# EAGLE design Nodemcu_Door_Sensor (EAGLE 7.2.0)
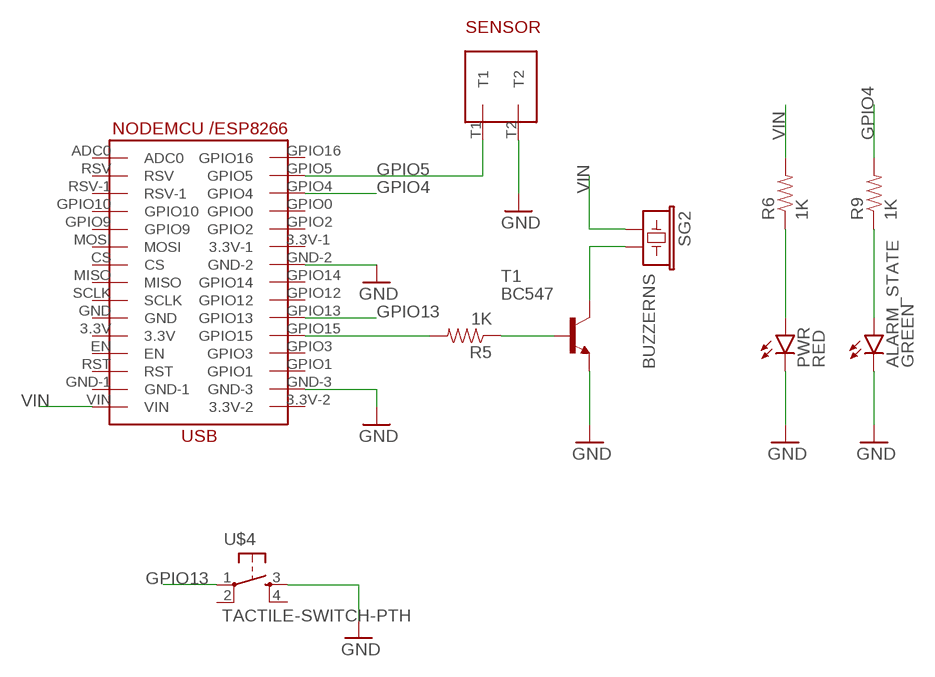
[diagram p0: schematic, sheet 1]

## Parts
ALARM_STATE  GREEN  LED3MM  [LED3MM]
PWR  RED  LED3MM  [LED3MM]
R5  1K  RESISTORPTH-1/4W  [AXIAL-0.4]
R6  1K  RESISTORPTH-1/4W  [AXIAL-0.4]
R9  1K  RESISTORPTH-1/4W  [AXIAL-0.4]
SENSOR  TER_CON_2PIN_ROINCOPTH  [TER_CON_2PIN_ROINCO]
SG2  BUZZERNS  [BUZZER-12MM-NS]
T1  BC547  [TO92]
U$1  ROINCO_NODEMCU_ESP8266  [ROINCO_NODEMCU_ESP8266]
U$4  TACTILE-SWITCH-PTH  [TAC-SWITCH-PTH]

## Nets
GND: ALARM_STATE.K(C) PWR.K(C) SENSOR.T2 T1.1(E) U$1.GND-2 U$1.GND-3 U$4.3
GPIO4: R9.P$2 U$1.GPIO4
GPIO5: SENSOR.T1 U$1.GPIO5
GPIO13: U$1.GPIO13 U$4.1
N$5: R5.P$2 U$1.GPIO15
N$8: R5.P$1 T1.2(B)
N$13: SG2.- T1.3(C)
N$16: PWR.A R6.P$1
N$18: ALARM_STATE.A R9.P$1
VIN: R6.P$2 SG2.+ U$1.VIN
Unconnected: U$1.3.3V U$1.3.3V-1 U$1.3.3V-2 U$1.ADC0 U$1.CS U$1.EN U$1.GND U$1.GND-1 U$1.GPIO0 U$1.GPIO1 U$1.GPIO2 U$1.GPIO3 U$1.GPIO9 U$1.GPIO10 U$1.GPIO12 U$1.GPIO14 U$1.GPIO16 U$1.MISO U$1.MOSI U$1.RST U$1.RSV U$1.RSV-1 U$1.SCLK U$4.2 U$4.4

## Notes on the sheet
- SENSOR

## Library data of the parts
ALARM_STATE PWR = SparkFun-LED:LED: LEDs Standard schematic elements and footprints for 5mm, 3mm, 1206, and 0603 sized LEDs. 5mm - Spark Fun Electronics SKU : COM-00529 (and others)
R5 R6 R9 = SparkFun-Resistors:RESISTOR: Resistor Basic schematic elements and footprints for 0603, 1206, and PTH resistors.
SENSOR = TER CON 2PIN ROINCO:TER_CON_2PIN_ROINCO
SG2 = SparkFun-Electromechanical:BUZZER: Buzzer 12mm Spark Fun Electronics SKU : Comp-Buzzer
T1 = transistor:BC547: NPN TRANSISTOR
U$1 = ESP8266 ESP32 ROINCO:ROINCO_NODEMCU_ESP8266
U$4 = GeekAmmo:TACTILE-SWITCH: Tactile Switch 4 Pins, SPST NO

## Board
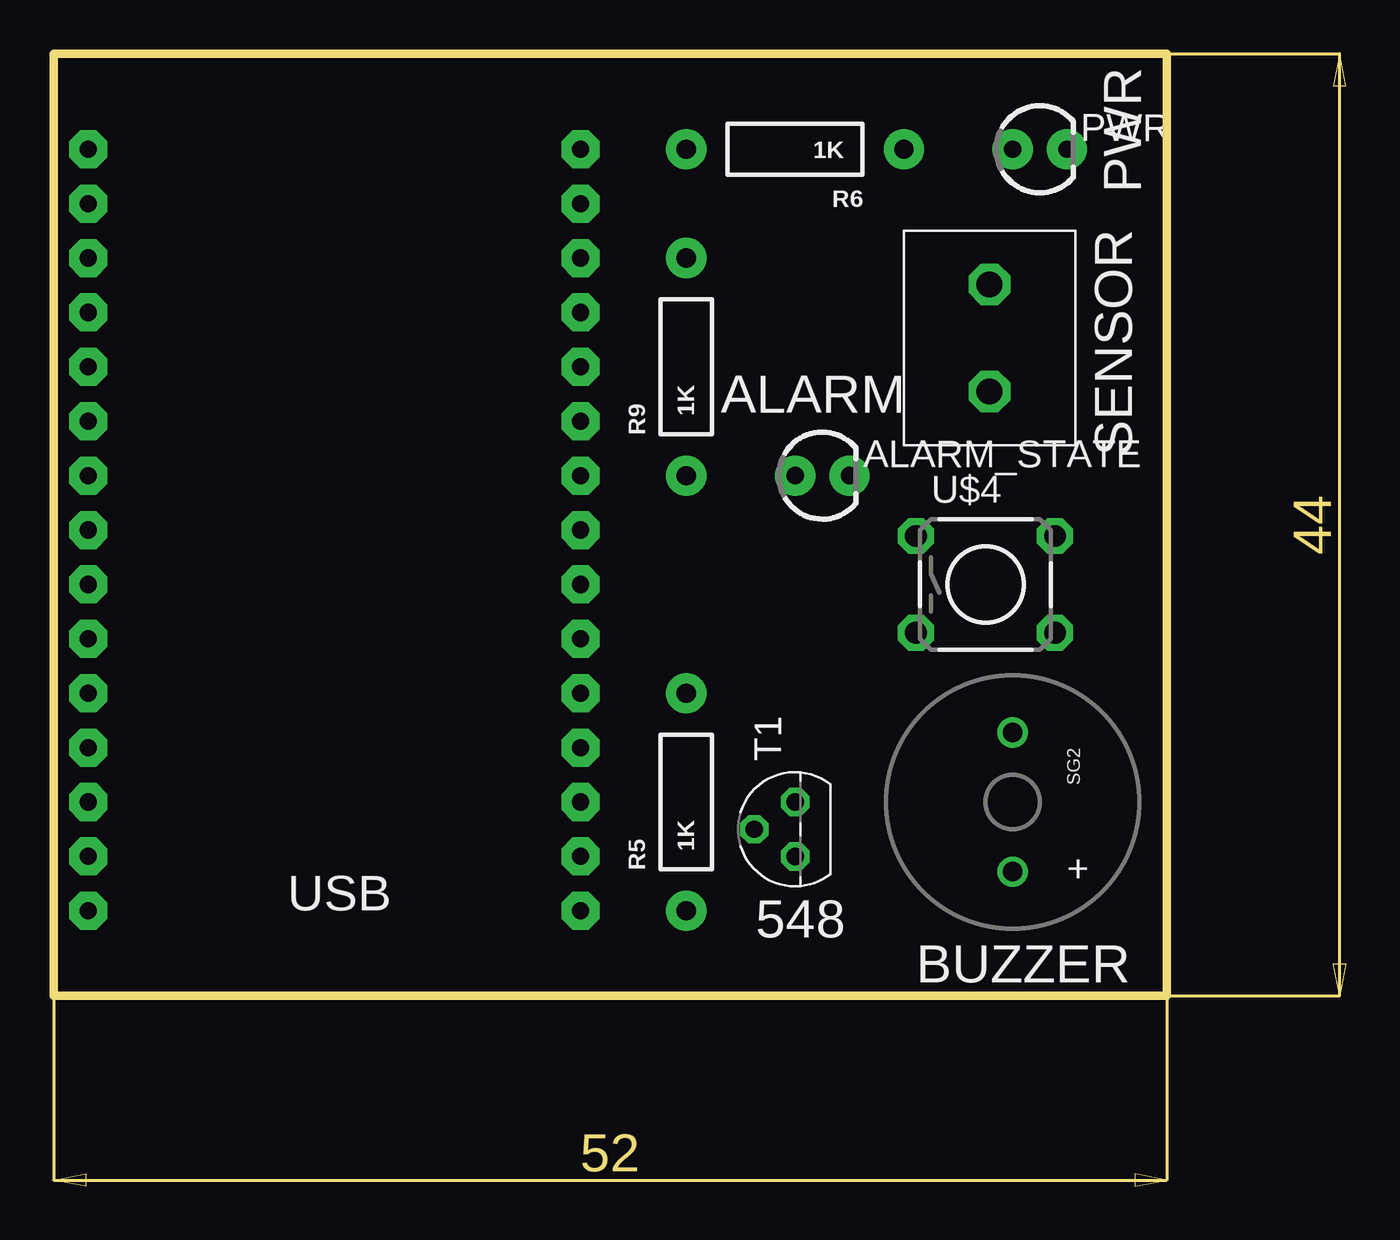
[diagram p1: board, top side]
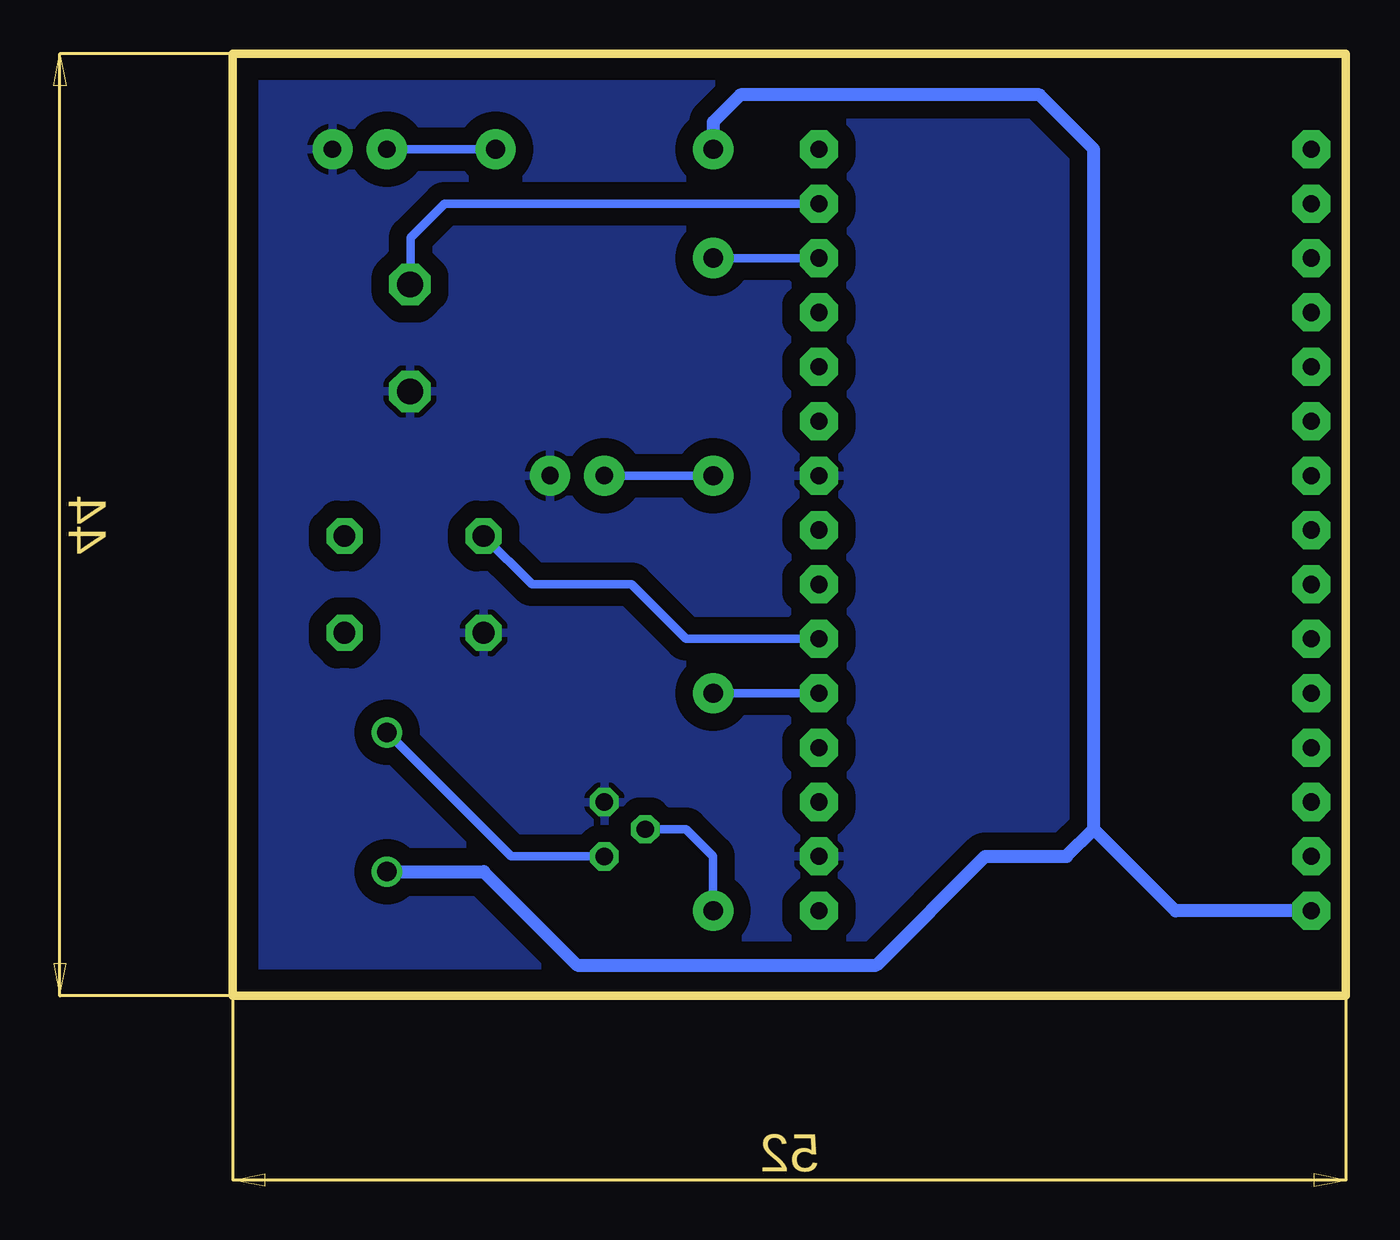
[diagram p2: board, bottom side, seen from below]

Size 52 x 44 mm. Coordinates in mm from the lower left corner, seen from the top.
Outline: 0,44 0,0 52,0 52,44 0,44
Copper layers (1*16): Top 0.035mm / dielectric 1.5mm / Bottom 0.035mm
Design rules "default": minimum track width 10mil, minimum drill 24mil, track to track 8mil, track to pad 8mil, pad to pad 8mil, via to via 8mil, smd to smd 8mil, copper to edge 40mil, drill to drill 8mil, minimum pad ring 10mil, minimum via ring 8mil, stop-mask expansion 4mil, vias tented up to drill 0mil, thermal gap 10mil

### Footprints (pad centres in the part's own frame; a part is rotated, then mirrored left to right if it is on the bottom)
LED3MM = drill 0.813 pad 1.88: A -1.27,0; K 1.27,0
AXIAL-0.4 = drill 0.9 pad 1.88: P$1 -5.08,0; P$2 5.08,0
TER_CON_2PIN_ROINCO = drill 1.2 pad 1.93 octagon: T1 2.5,4; T2 7.5,4
BUZZER-12MM-NS = drill 0.9: + 3.25,0; - -3.25,0
TO92 = drill 0.813 octagon: 1 1.27,0; 2 0,1.905; 3 -1.27,0
ROINCO_NODEMCU_ESP8266 = drill 0.8 pad 1.778 octagon: 3.3V 0,10.16; 3.3V-1 23,22.86; 3.3V-2 23,0; ADC0 0,35.56; CS 0,20.32; EN 0,7.62; GND 0,12.7; GND-1 0,2.54; GND-2 23,20.32; GND-3 23,2.54; GPIO0 23,27.94; GPIO1 23,5.08; GPIO2 23,25.4; GPIO3 23,7.62; GPIO4 23,30.48; GPIO5 23,33.02; GPIO9 0,25.4; GPIO10 0,27.94; GPIO12 23,15.24; GPIO13 23,12.7; GPIO14 23,17.78; GPIO15 23,10.16; GPIO16 23,35.56; MISO 0,17.78; MOSI 0,22.86; RST 0,5.08; RSV 0,33.02; RSV-1 0,30.48; SCLK 0,15.24; VIN 0,0
TAC-SWITCH-PTH = drill 1.016 pad 1.676 octagon: 1 -3.251,2.261; 2 3.251,2.261; 3 -3.251,-2.261; 4 3.251,-2.261

### Placement (x,y rotation side)
ALARM_STATE  35.91,24.29 0 top
PWR  46.07,39.53 0 top
R5  29.56,9.05 90 top
R6  34.64,39.53 180 top
R9  29.56,29.37 90 top
SENSOR  39.72,35.72 270 top
SG2  44.8,9.05 270 top
T1  34.64,7.78 90 top
U$1  1.62,3.97 0 top
U$4  43.53,19.21 0 top

### Tracks (layer width: path | path; a pad name or v marks a point on that pad's centre or on a via)
GND
  pour Bottom (isolate 0.813): -1,45 -1,-2 53,-2 53,45
GPIO4
  Bottom 0.406: U$1.GPIO4 R9.P$2
GPIO5
  Bottom 0.406: U$1.GPIO5 42.11,36.99 43.7,35.4 43.7,33.24 SENSOR.T1
GPIO13
  Bottom 0.406: U$1.GPIO13 30.83,16.67 33.37,19.21 38.02,19.21 U$4.1
N$5
  Bottom 0.406: U$1.GPIO15 R5.P$2
N$8
  Bottom 0.406: R5.P$1 29.56,6.51 30.83,7.78 T1.2
N$13
  Bottom 0.406: T1.3 39.01,6.51 SG2.-
N$16
  Bottom 0.406: R6.P$1 PWR.A
N$18
  Bottom 0.406: R9.P$1 ALARM_STATE.A
VIN
  Bottom 0.61: U$1.VIN 7.97,3.97 11.78,7.78 | 11.78,7.78 11.78,39.53 14.32,42.07 28.29,42.07 29.56,40.8 R6.P$2 | SG2.+ 40.28,5.8 35.91,1.43 21.94,1.43 16.86,6.51 13.05,6.51 11.78,7.78

### Text on the board
tPlace: PWR | SENSOR | ALARM | + | 548 | BUZZER